# EAGLE schematic inktime_v6 (EAGLE 9.6.2)

## Sheet 1 of 2
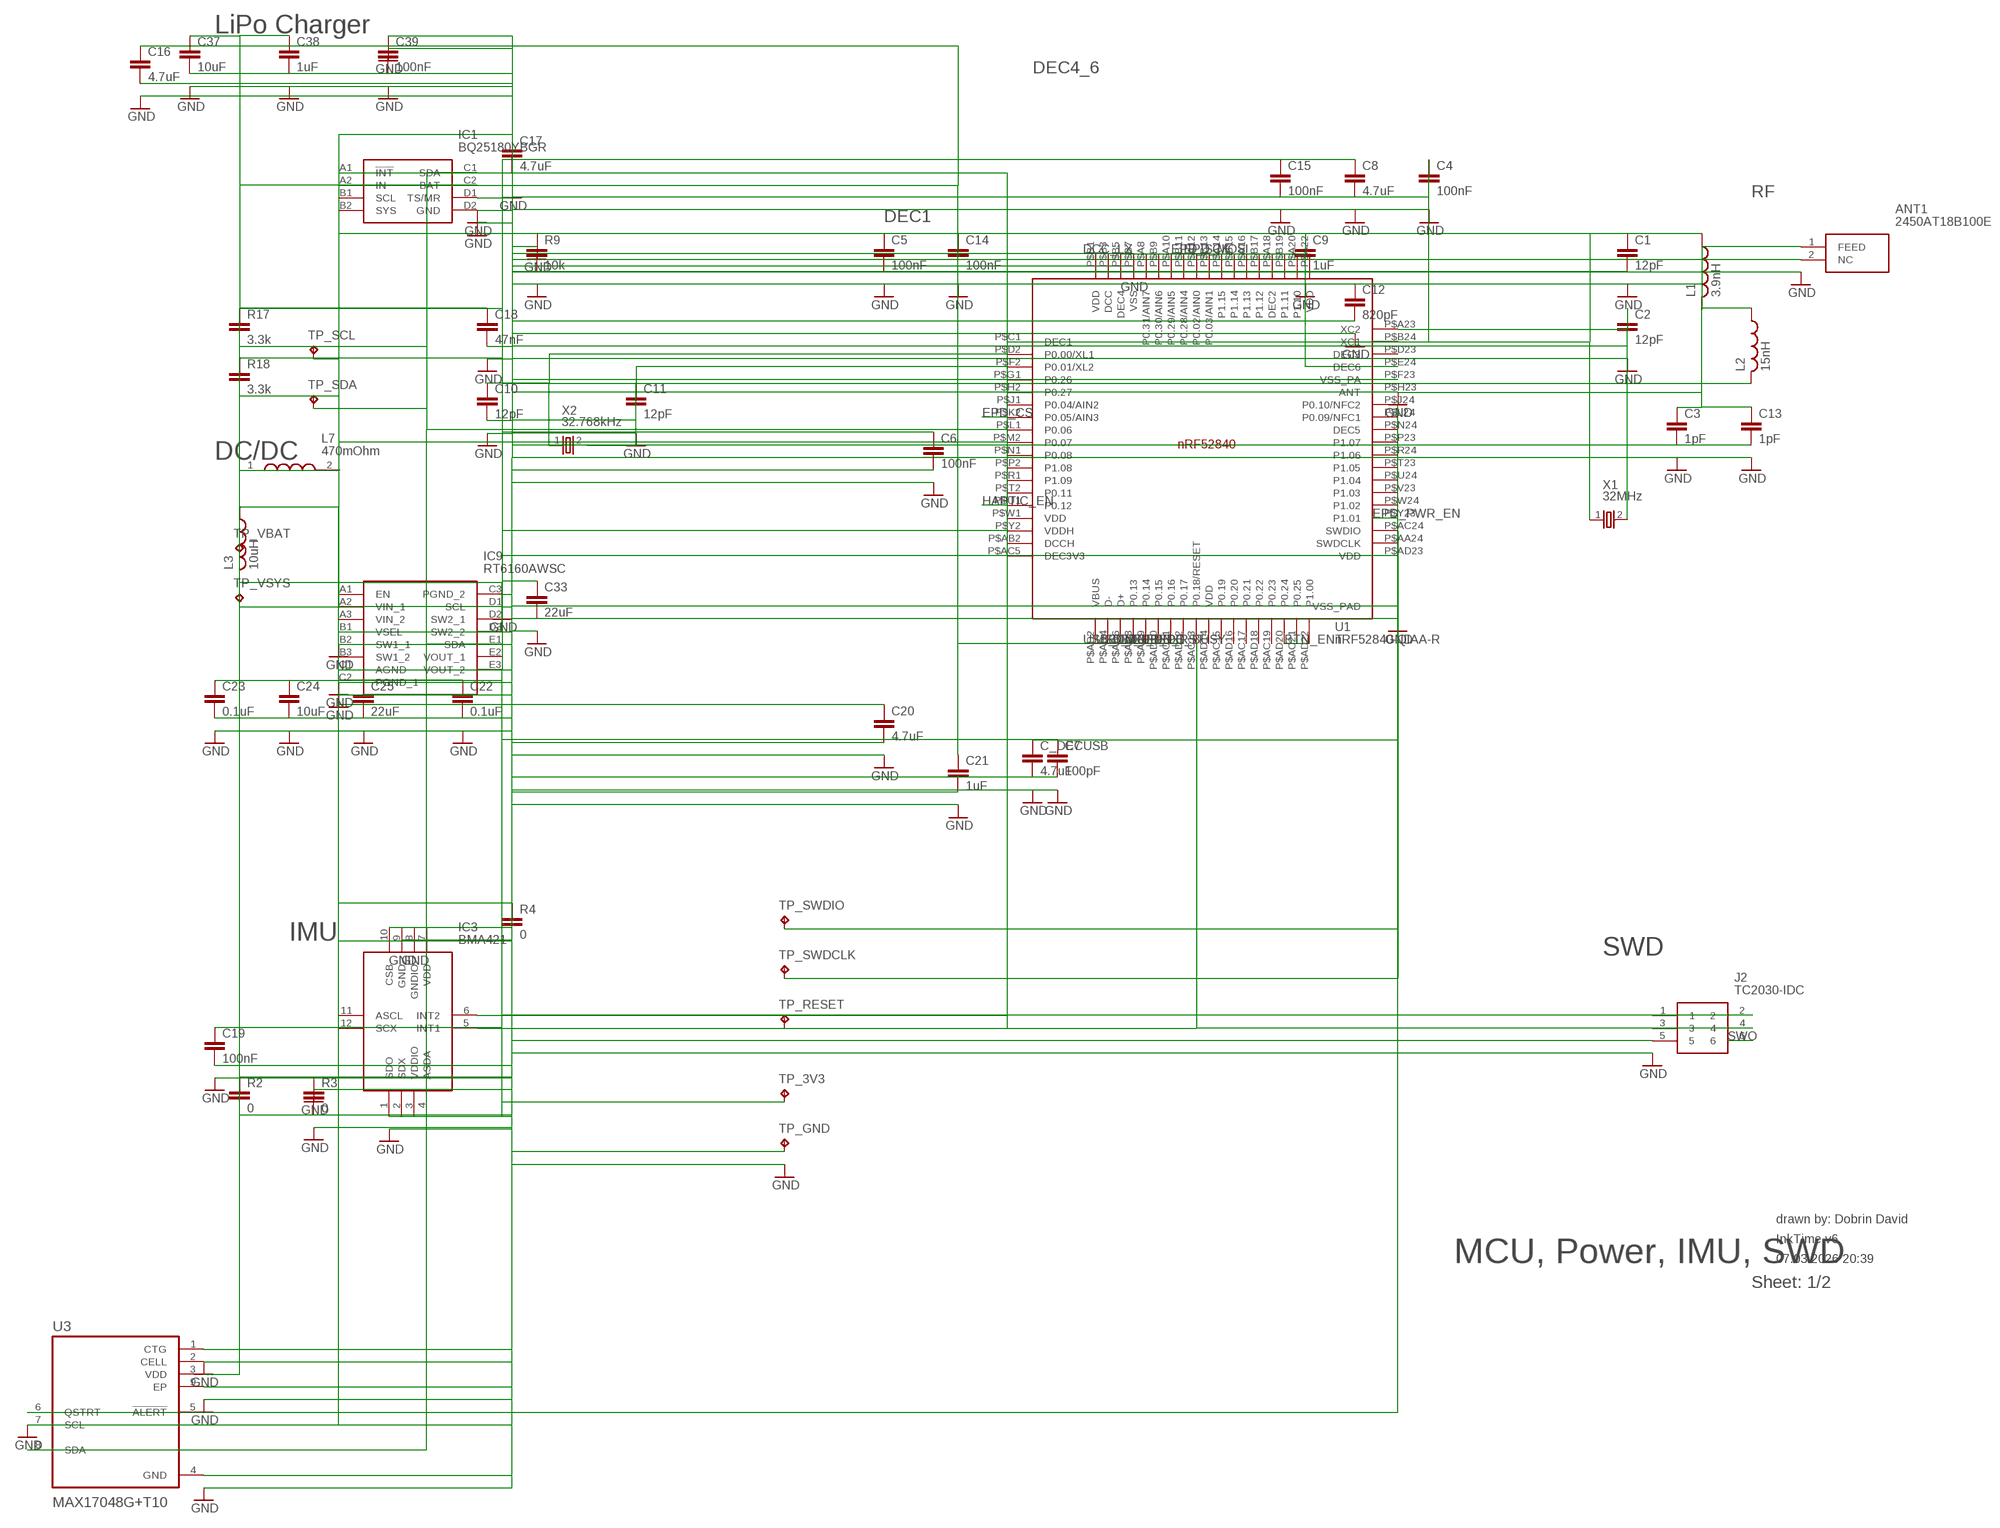
[diagram p0: schematic, sheet 1]

### Parts
ANT1  2450AT18B100E  2450AT18B100E_2450AT18B100E  [2450AT18B100E_ANTC3216X140N]
C1  12pF  PERFECT_0402_CAP_0402  [PERFECT_0402_0402]
C2  12pF  PERFECT_0402_CAP_0402  [PERFECT_0402_0402]
C3  1pF  PERFECT_0402_CAP_0402  [PERFECT_0402_0402]
C4  100nF  PERFECT_0402_CAP_0402  [PERFECT_0402_0402]
C5  100nF  PERFECT_0402_CAP_0402  [PERFECT_0402_0402]
C6  100nF  PERFECT_0402_CAP_0402  [PERFECT_0402_0402]
C7  100pF  PERFECT_0402_CAP_0402  [PERFECT_0402_0402]
C8  4.7uF  PERFECT_0402_CAP_0402  [PERFECT_0402_0402]
C9  1uF  PERFECT_0402_CAP_0402  [PERFECT_0402_0402]
C10  12pF  PERFECT_0402_CAP_0402  [PERFECT_0402_0402]
C11  12pF  PERFECT_0402_CAP_0402  [PERFECT_0402_0402]
C12  820pF  PERFECT_0402_CAP_0402  [PERFECT_0402_0402]
C13  1pF  PERFECT_0402_CAP_0402  [PERFECT_0402_0402]
C14  100nF  PERFECT_0402_CAP_0402  [PERFECT_0402_0402]
C15  100nF  PERFECT_0402_CAP_0402  [PERFECT_0402_0402]
C16  4.7uF  PERFECT_0402_CAP_0402  [PERFECT_0402_0402]
C17  4.7uF  PERFECT_0402_CAP_0402  [PERFECT_0402_0402]
C18  47nF  PERFECT_0402_CAP_0402  [PERFECT_0402_0402]
C19  100nF  PERFECT_0402_CAP_0402  [PERFECT_0402_0402]
C20  4.7uF  PERFECT_0402_CAP_0402  [PERFECT_0402_0402]
C21  1uF  PERFECT_0402_CAP_0402  [PERFECT_0402_0402]
C22  0.1uF  PERFECT_0402_CAP_0402  [PERFECT_0402_0402]
C23  0.1uF  PERFECT_0402_CAP_0402  [PERFECT_0402_0402]
C24  10uF  PERFECT_0402_CAP_0402  [PERFECT_0402_0402]
C25  22uF  PERFECT_0402_CAP_0402  [PERFECT_0402_0402]
C33  22uF  PERFECT_0402_CAP_0402  [PERFECT_0402_0402]
C37  10uF  PERFECT_0402_CAP_0402  [PERFECT_0402_0402]
C38  1uF  PERFECT_0402_CAP_0402  [PERFECT_0402_0402]
C39  100nF  PERFECT_0402_CAP_0402  [PERFECT_0402_0402]
C_DECUSB  4.7uF  PERFECT_0402_CAP_0402  [PERFECT_0402_0402]
IC1  BQ25180YBGR  BQ25180YBGR_BQ25180YBGR  [BQ25180YBGR_BGA8C40P2X4_100X155X50]
IC3  BMA421  BMA423_BMA423  [BMA423_BMA423]
IC9  RT6160AWSC  RT6160AWSC_RT6160AWSC  [RT6160AWSC_BGA15C40P3X5_140X230X60]
J2  TC2030-IDC  TC2030-IDC_TC2030-IDC  [TC2030-IDC_TC2030IDC]
L1  3.9nH  NORDIC_NRF_2_INDUCTOR_0402_N  [NORDIC_NRF_2_RESC0402_N]
L2  15nH  NORDIC_NRF_2_INDUCTOR_0402_N  [NORDIC_NRF_2_RESC0402_N]
L3  10uH  NORDIC_NRF_2_INDUCTOR_0402_N  [NORDIC_NRF_2_RESC0402_N]
L7  470mOhm  MLP2016SR47MT0S1_FTC252012SR47MBCA  [MLP2016SR47MT0S1_INDC2016X100N]
R2  0  PERFECT_0402_CAP_0402  [PERFECT_0402_0402]
R3  0  PERFECT_0402_CAP_0402  [PERFECT_0402_0402]
R4  0  PERFECT_0402_CAP_0402  [PERFECT_0402_0402]
R9  10k  PERFECT_0402_CAP_0402  [PERFECT_0402_0402]
R17  3.3k  PERFECT_0402_CAP_0402  [PERFECT_0402_0402]
R18  3.3k  PERFECT_0402_CAP_0402  [PERFECT_0402_0402]
TP_3V3  TP  HECTOR_WATCH_1_TPTP20R  [HECTOR_WATCH_1_TP20R]
TP_GND  TP  HECTOR_WATCH_1_TPTP20R  [HECTOR_WATCH_1_TP20R]
TP_RESET  TP  HECTOR_WATCH_1_TPTP20R  [HECTOR_WATCH_1_TP20R]
TP_SCL  TP  HECTOR_WATCH_1_TPTP20R  [HECTOR_WATCH_1_TP20R]
TP_SDA  TP  HECTOR_WATCH_1_TPTP20R  [HECTOR_WATCH_1_TP20R]
TP_SWDCLK  TP  HECTOR_WATCH_1_TPTP20R  [HECTOR_WATCH_1_TP20R]
TP_SWDIO  TP  HECTOR_WATCH_1_TPTP20R  [HECTOR_WATCH_1_TP20R]
TP_VBAT  TP  HECTOR_WATCH_1_TPTP20R  [HECTOR_WATCH_1_TP20R]
TP_VSYS  TP  HECTOR_WATCH_1_TPTP20R  [HECTOR_WATCH_1_TP20R]
U1  nRF52840-QIAA-R  NORDIC_NRF_4_NRF52840_QF  [NORDIC_NRF_4_AQFN50P700X700X85_HS-74N]
U3  MAX17048G+T10  ESP32_C6_LIBRARY_MAX17048G+T10  [ESP32_C6_LIBRARY_SON50P200X200X80-9N]
X1  32MHz  NORDIC_NRF_1_XTAL_32KHZ  [NORDIC_NRF_1_XTAL_3215_N]
X2  32.768kHz  NORDIC_NRF_1_XTAL_32KHZ  [NORDIC_NRF_1_XTAL_3215_N]

### Nets
3V3 [Power]: C5.1 C6.1 C7.1 C8.1 C14.1 C15.1 C19.1 C24.1 C25.1 C33.1 IC3.3(VDDIO) IC3.7(VDD) IC3.10(CSB) IC9.E2(VOUT_1) IC9.E3(VOUT_2) J2.1 R2.1 R2.2 R17.1 R18.1 TP_3V3.TP U1.P$AD23(VDD) U1.P$Y2(VDDH) ; also sheet 2
BTN_DN: U1.P$AC9(P0.14) ; also sheet 2
BTN_ENT: U1.P$AD22(P1.00) ; also sheet 2
BTN_UP: U1.P$AD8(P0.13) ; also sheet 2
DCC_LX: U1.P$B3(DCC)
DEC1: C4.1 U1.P$C1(DEC1)
DEC4_6: C9.1 U1.P$B5(DEC4) U1.P$E24(DEC6)
DECUSB: C_DECUSB.1 U1.P$N24(DEC5)
EPD_BUSY: U1.P$AD12(P0.17)
EPD_CS: U1.P$K2(P0.05/AIN3) ; also sheet 2
EPD_DC: U1.P$AD10(P0.15) ; also sheet 2
EPD_MOSI: U1.P$B13(P0.03/AIN1) ; also sheet 2
EPD_PWR_EN: U1.P$Y23(P1.01) ; also sheet 2
EPD_RST: U1.P$AC11(P0.16)
EPD_SCK: U1.P$A12(P0.02/AIN0) ; also sheet 2
FUEL_ALRT: U1.P$J24(P0.10/NFC2) U3.5(!ALERT)
GND [Power]: ANT1.2(NC) C1.2 C2.2 C3.2 C4.2 C5.2 C6.2 C7.2 C8.2 C9.2 C10.2 C11.2 C12.2 C13.2 C14.2 C15.2 C16.2 C17.2 C18.2 C19.2 C20.2 C21.2 C22.2 C23.2 C24.2 C25.2 C33.2 C37.2 C38.2 C39.1 C39.2 C_DECUSB.2 IC1.D1(TS/MR) IC1.D2(GND) IC3.1(SDO) IC3.8(GNDIO) IC3.9(GND) IC9.B1(VSEL) IC9.C1(AGND) IC9.C2(PGND_1) IC9.C3(PGND_2) J2.5 R3.1 R3.2 R9.1 R9.2 TP_GND.TP U1.P$74(VSS_PAD) U1.P$75(VSS_PAD) U1.P$76(VSS_PAD) U1.P$77(VSS_PAD) U1.P$78(VSS_PAD) U1.P$79(VSS_PAD) U1.P$80(VSS_PAD) U1.P$81(VSS_PAD) U1.P$82(VSS_PAD) U1.P$83(VSS_PAD) U1.P$84(VSS_PAD) U1.P$85(VSS_PAD) U1.P$86(VSS_PAD) U1.P$87(VSS_PAD) U1.P$88(VSS_PAD) U1.P$89(VSS_PAD) U1.P$90(VSS_PAD) U1.P$B7(VSS) U1.P$F23(VSS_PA) U3.1(CTG) U3.4(GND) U3.6(QSTRT) U3.9(EP) ; also sheet 2
HAPTIC_EN: U1.P$U1(P0.12) ; also sheet 2
IMU_INT1: IC3.5(INT1) U1.P$N1(P0.08)
IMU_INT2: IC3.6(INT2) U1.P$P2(P1.08)
nRESET: J2.3 TP_RESET.TP U1.P$AC13(P0.18/RESET)
PMIC_INT: IC1.A1(!INT) U1.P$T2(P0.11)
RF_ANT: ANT1.1(FEED) C3.1 C12.1 C13.1 L1.2 L2.1 U1.P$H23(ANT)
RF_LX1: IC9.B2(SW1_1) IC9.B3(SW1_2) L1.1 L3.1
RF_LX2: IC9.D2(SW2_1) IC9.D3(SW2_2) L2.2 L3.2
SCL: IC1.B1(SCL) IC3.11(ASCL) IC3.12(SCX) IC9.D1(SCL) R4.1 R4.2 R18.2 TP_SCL.TP U1.P$M2(P0.07) U3.7(SCL) ; also sheet 2
SDA: IC1.C1(SDA) IC3.2(SDX) IC3.4(ASDA) IC9.E1(SDA) R17.2 TP_SDA.TP U1.P$L1(P0.06) U3.8(SDA) ; also sheet 2
SWDCLK: J2.4 TP_SWDCLK.TP U1.P$AA24(SWDCLK)
SWDIO: J2.2 TP_SWDIO.TP U1.P$AC24(SWDIO)
SWO: J2.6
USB_DM: U1.P$AD4(D-) ; also sheet 2
USB_DP: U1.P$AD6(D+) ; also sheet 2
VBAT [Power]: C18.1 C37.1 C38.1 IC1.C2(BAT) TP_VBAT.TP U3.2(CELL) U3.3(VDD)
VBUS [Power]: C16.1 C21.1 IC1.A2(IN) U1.P$AD2(VBUS) ; also sheet 2
VSYS [Power]: C17.1 C20.1 C22.1 C23.1 IC1.B2(SYS) IC9.A1(EN) IC9.A2(VIN_1) IC9.A3(VIN_2) L7.1 L7.2 TP_VSYS.TP
XC1_32K: C1.1 U1.P$B24(XC1) X1.1
XC2_32K: C2.1 U1.P$A23(XC2) X1.2
XL1: C10.1 U1.P$D2(P0.00/XL1) X2.1
XL2: C11.1 U1.P$F2(P0.01/XL2) X2.2
Unconnected: U1.P$A8(P0.31/AIN7) U1.P$A10(P0.29/AIN5) U1.P$A14(P1.15) U1.P$A16(P1.13) U1.P$A18(DEC2) U1.P$A20(P1.10) U1.P$AB2(DCCH) U1.P$AC5(DEC3V3) U1.P$AC15(P0.19) U1.P$AC17(P0.21) U1.P$AC19(P0.23) U1.P$AC21(P0.25) U1.P$AD16(P0.20) U1.P$AD18(P0.22) U1.P$AD20(P0.24) U1.P$B9(P0.30/AIN6) U1.P$B11(P0.28/AIN4) U1.P$B15(P1.14) U1.P$B17(P1.12) U1.P$B19(P1.11) U1.P$D23(DEC3) U1.P$G1(P0.26) U1.P$H2(P0.27) U1.P$J1(P0.04/AIN2) U1.P$L24(P0.09/NFC1) U1.P$P23(P1.07) U1.P$R1(P1.09) U1.P$R24(P1.06) U1.P$T23(P1.05) U1.P$U24(P1.04) U1.P$V23(P1.03) U1.P$W24(P1.02)

### Notes on the sheet
- LiPo Charger
- DEC4_6
- RF
- DEC1
- DC/DC
- IMU
- SWD
- drawn by: Dobrin David
- InkTime v6
- MCU, Power, IMU, SWD | 07.03.2026 20:39
- Sheet: 1/2

## Sheet 2 of 2
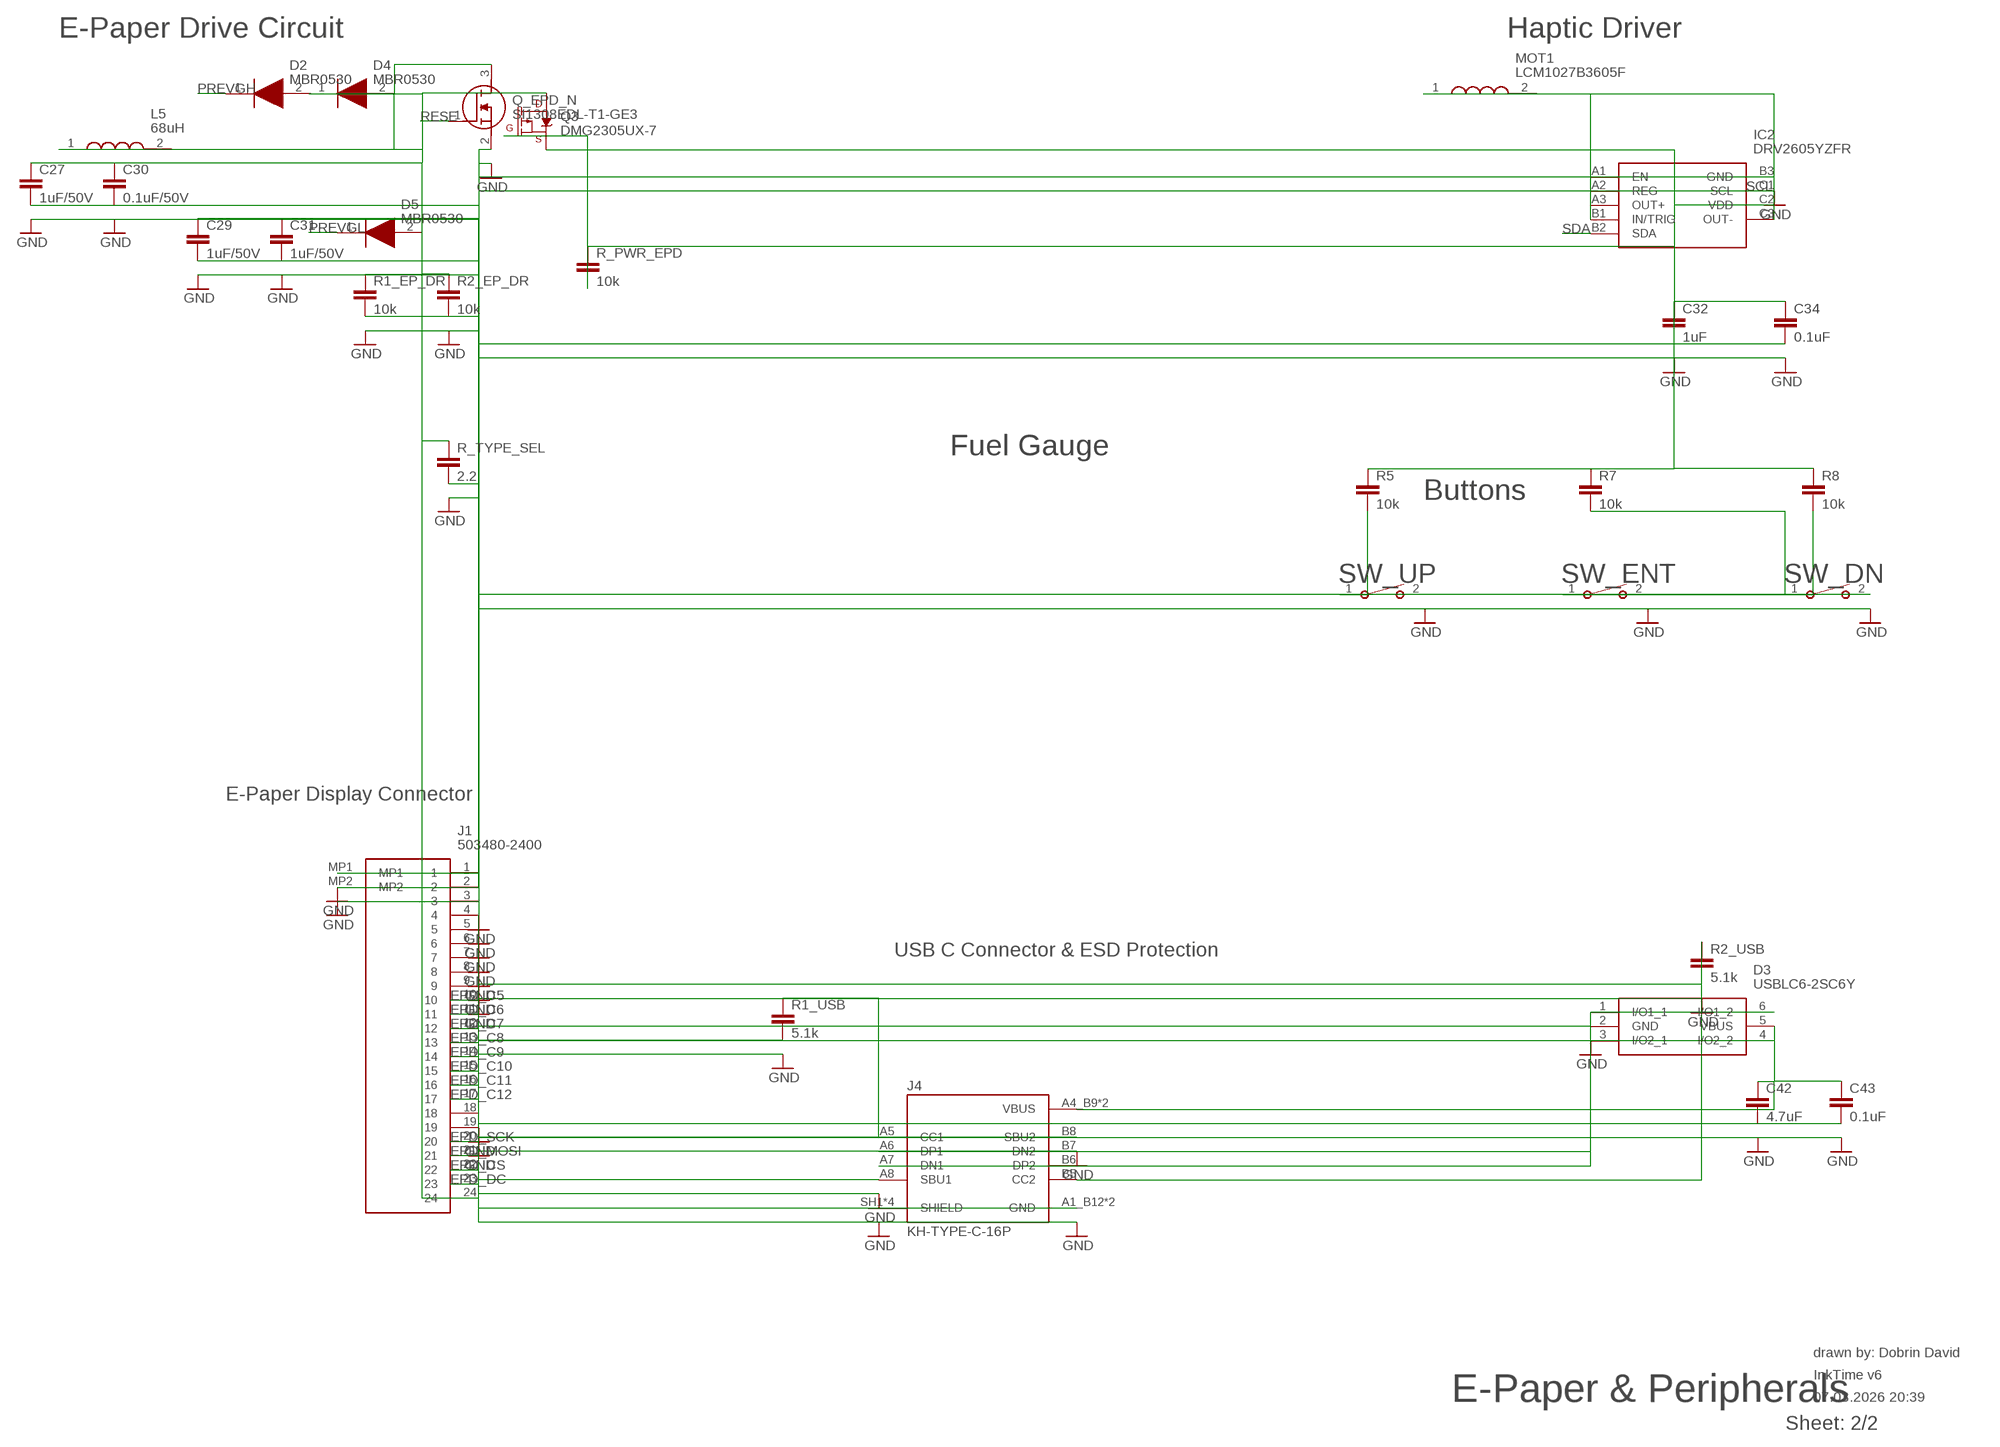
[diagram p1: schematic, sheet 2]

### Parts
C27  1uF/50V  PERFECT_0402_CAP_0402  [PERFECT_0402_0402]
C29  1uF/50V  PERFECT_0402_CAP_0402  [PERFECT_0402_0402]
C30  0.1uF/50V  PERFECT_0402_CAP_0402  [PERFECT_0402_0402]
C31  1uF/50V  PERFECT_0402_CAP_0402  [PERFECT_0402_0402]
C32  1uF  PERFECT_0402_CAP_0402  [PERFECT_0402_0402]
C34  0.1uF  PERFECT_0402_CAP_0402  [PERFECT_0402_0402]
C42  4.7uF  PERFECT_0402_CAP_0402  [PERFECT_0402_0402]
C43  0.1uF  PERFECT_0402_CAP_0402  [PERFECT_0402_0402]
D2  MBR0530  ESP32_C6_LIBRARY_5_MBR0530  [ESP32_C6_LIBRARY_5_SOD3716X135N]
D3  USBLC6-2SC6Y  ESP32_C6_LIBRARY_3_USBLC6-2SC6Y  [ESP32_C6_LIBRARY_3_SOT95P280X145-6N]
D4  MBR0530  ESP32_C6_LIBRARY_5_MBR0530  [ESP32_C6_LIBRARY_5_SOD3716X135N]
D5  MBR0530  ESP32_C6_LIBRARY_5_MBR0530  [ESP32_C6_LIBRARY_5_SOD3716X135N]
IC2  DRV2605YZFR  DRV2605YZFR_DRV2605YZFR  [DRV2605YZFR_BGA9C50P3X3_144X144X62]
J1  503480-2400  503480-2400_503480-2400  [503480-2400_5034802400]
J4  KH-TYPE-C-16P  KH-TYPE-C-16P_KH-TYPE-C-16P  [KH-TYPE-C-16P_KINGHELM_KH-TYPE-C-16P]
L5  68uH  MLP2016SR47MT0S1_FTC252012SR47MBCA  [MLP2016SR47MT0S1_INDC2016X100N]
MOT1  LCM1027B3605F  MLP2016SR47MT0S1_FTC252012SR47MBCA  [MLP2016SR47MT0S1_INDC2016X100N]
Q3  DMG2305UX-7  ESP32_C6_LIBRARY_4_ESP32_WROVER_SPARKFUN-DISCRETESEMI_MOSFET_PCH-SI2309DS  [ESP32_C6_LIBRARY_4_ESP32_C6_LIBRARY_4_ESP32_C6_LIBRARY_4_ESP32_C6_LIBRARY_4_ESP32_WROVER_SPARKFUN-DISCRETESEMI_SOT23-3]
Q_EPD_N  SI1308EDL-T1-GE3  ESP32_C6_LIBRARY_6_SI1308EDL-T1-GE3  [ESP32_C6_LIBRARY_6_SOT65P210X110-3N]
R1_EP_DR  10k  PERFECT_0402_CAP_0402  [PERFECT_0402_0402]
R1_USB  5.1k  PERFECT_0402_CAP_0402  [PERFECT_0402_0402]
R2_EP_DR  10k  PERFECT_0402_CAP_0402  [PERFECT_0402_0402]
R2_USB  5.1k  PERFECT_0402_CAP_0402  [PERFECT_0402_0402]
R5  10k  PERFECT_0402_CAP_0402  [PERFECT_0402_0402]
R7  10k  PERFECT_0402_CAP_0402  [PERFECT_0402_0402]
R8  10k  PERFECT_0402_CAP_0402  [PERFECT_0402_0402]
R_PWR_EPD  10k  PERFECT_0402_CAP_0402  [PERFECT_0402_0402]
R_TYPE_SEL  2.2  PERFECT_0402_CAP_0402  [PERFECT_0402_0402]
SW_DN  SW_PUSH  2025-10-22_07-23-44_LIBRARY_EVP-AKE31ASW_EVP-AKE31A_PAN  [2025-10-22_07-23-44_LIBRARY_SW_EVP-AKE31A_PAN]
SW_ENT  SW_PUSH  2025-10-22_07-23-44_LIBRARY_EVP-AKE31ASW_EVP-AKE31A_PAN  [2025-10-22_07-23-44_LIBRARY_SW_EVP-AKE31A_PAN]
SW_UP  SW_PUSH  2025-10-22_07-23-44_LIBRARY_EVP-AKE31ASW_EVP-AKE31A_PAN  [2025-10-22_07-23-44_LIBRARY_SW_EVP-AKE31A_PAN]

### Nets
3V3 [Power]: C32.1 C34.1 IC2.C2(VDD) Q3.2(S) R5.1 R7.1 R8.1 R_PWR_EPD.1 ; also sheet 1
BTN_DN: R7.2 SW_DN.1 ; also sheet 1
BTN_ENT: R8.2 SW_ENT.1 ; also sheet 1
BTN_UP: R5.2 SW_UP.1 ; also sheet 1
EPD_3V3 [Power]: C27.1 C30.1 D4.1(K) D5.2(A) J1.24 L5.2 Q3.3(D) R1_EP_DR.1 R2_EP_DR.1 R_TYPE_SEL.1
EPD_C1: C29.1 J1.2
EPD_C2: C31.1 J1.1
EPD_C5: J1.10
EPD_C6: J1.11
EPD_C7: J1.12
EPD_C8: J1.13
EPD_C9: J1.14
EPD_C10: J1.15
EPD_C11: J1.16
EPD_C12: J1.17
EPD_CS: J1.22 ; also sheet 1
EPD_DC: J1.23 ; also sheet 1
EPD_MOSI: J1.21 ; also sheet 1
EPD_PWR_EN: Q3.1(G) R_PWR_EPD.2 ; also sheet 1
EPD_SCK: J1.20 ; also sheet 1
GND [Power]: C27.2 C29.2 C30.2 C31.2 C32.2 C34.2 C42.2 C43.2 D3.2(GND) IC2.B3(GND) J1.3 J1.4 J1.5 J1.6 J1.7 J1.8 J1.9 J1.18 J1.19 J1.MP1 J1.MP2 J4.A1_B12(GND) J4.A8(SBU1) J4.A12_B1(GND) J4.B8(SBU2) J4.SH1(SHIELD) J4.SH2(SHIELD) J4.SH3(SHIELD) J4.SH4(SHIELD) Q_EPD_N.2(S) R1_EP_DR.2 R1_USB.2 R2_EP_DR.2 R2_USB.2 R_TYPE_SEL.2 SW_DN.2 SW_ENT.2 SW_UP.2 ; also sheet 1
HAPTIC_EN: IC2.A1(EN) IC2.B1(IN/TRIG) ; also sheet 1
HAPTIC_OUT_N: IC2.C3(OUT-) MOT1.2
HAPTIC_OUT_P: IC2.A3(OUT+) MOT1.1
LX_EPD: D2.2(A) D4.2(A) L5.1 Q_EPD_N.3(D)
PREVGH: D2.1(K)
PREVGL: D5.1(K)
RESE: Q_EPD_N.1(G)
SCL: IC2.C1(SCL) ; also sheet 1
SDA: IC2.B2(SDA) ; also sheet 1
USB_CC1: J4.A5(CC1) R1_USB.1
USB_CC2: J4.B5(CC2) R2_USB.1
USB_DM: D3.3(I/O2_1) D3.4(I/O2_2) J4.A7(DN1) J4.B7(DN2) ; also sheet 1
USB_DP: D3.1(I/O1_1) D3.6(I/O1_2) J4.A6(DP1) J4.B6(DP2) ; also sheet 1
VBUS [Power]: C42.1 C43.1 D3.5(VBUS) J4.A4_B9(VBUS) J4.A9_B4(VBUS) ; also sheet 1
Unconnected: IC2.A2(REG)

### Notes on the sheet
- E-Paper Drive Circuit | Haptic Driver
- Fuel Gauge
- Buttons
- E-Paper Display Connector
- USB C Connector & ESD Protection
- drawn by: Dobrin David
- InkTime v6
- E-Paper & Peripherals | 07.03.2026 20:39
- Sheet: 2/2

## Power pins joined to a net without a drawn wire
VDD: U1.P$A22(VDD) U1.P$AD14(VDD) U1.P$B1(VDD) U1.P$W1(VDD)

## Library data of the parts
ANT1 = inktime_v5:2450AT18B100E_2450AT18B100E: Antennas 2.45GHz ANTENNA Source: Datasheet <https://www.johansontechnology.com/datasheets/2450AT18B100/2450AT18B100.pdf>
C1-C25 C27 C29-C34 C37-C39 C42 C43 C_DECUSB R1_EP_DR R1_USB R2 R2_EP_DR R2_USB R3-R5 R7-R9 R17 R18 R_PWR_EPD R_TYPE_SEL = inktime_v5:PERFECT_0402_CAP_0402: 0402 (1005 Metric) Nick Garner - TeleSense
D2 D4 D5 = inktime_v5:ESP32_C6_LIBRARY_5_MBR0530: ON SEMICONDUCTOR - MBR0530 - DIODE, SCHOTTKY, 0.5A, 30V, SOD-123 Source: Datasheet <http://www.onsemi.com/pub/Collateral/MBR0530T1-D.PDF> Check availability <https://pricing.snapeda.com/parts/MBR0530/ON%20Semiconductor/view-part?ref=eda>
D3 = inktime_v5:ESP32_C6_LIBRARY_3_USBLC6-2SC6Y: Low Cap. ESD Protection Auto SOT-23-6 STMicroelectronics USBLC6-2SC6Y, Dual Uni-Directional TVS Diode Array, 6-Pin SOT-23 Source: Datasheet <https://componentsearchengine.com/Datasheets/1/USBLC6-2SC6Y.pdf> Check availability <https://pricing.snapeda.com/parts/USBLC6-2SC6Y/STMicroelectronics/view-part?ref=eda>
IC1 = inktime_v5:BQ25180YBGR_BQ25180YBGR: Charger IC Lithium Ion/Polymer, Lithium Iron Phosphate 8-DSBGA (1.6x1.1) Source: Datasheet <https://www.ti.com/lit/ds/symlink/bq25180.pdf?ts=1650264094470&ref_url=https%3A%2F%2Fwww.ti.com%2Fproduct%2FBQ25180>
IC2 = inktime_v5:DRV2605YZFR_DRV2605YZFR: Haptic Driver for ERM/LRA with Built-In Library and Smart Loop Architecture Source: Datasheet <http://www.ti.com/lit/gpn/drv2605>
IC3 = inktime_v5:BMA423_BMA423: Accelerometers Triaxial low-g 12bit Acceleration Sensor Source: Datasheet <https://www.mouser.com/datasheet/2/783/BST-BMA423-DS000-1509600.pdf>
IC9 = inktime_v5:RT6160AWSC_RT6160AWSC: Buck-Boost Regulator Positive Output Step-Up/Step-Down I2C DC-DC Controller IC 15-WL-CSP (BSC) (1.4x2.3) Source: Datasheet <https://www.richtek.com/SaveDownload.aspx?specid=RT6160A>
J1 = inktime_v5:503480-2400_503480-2400: FFC & FPC Connectors 0.5mm FPC RA SMT Dual Contact 24Ckt Source: Datasheet <https://componentsearchengine.com/Datasheets/1/503480-2400.pdf>
J2 = inktime_v5:TC2030-IDC_TC2030-IDC: CABLE ADAPTER 6 POS Source: Datasheet <https://datasheet.datasheetarchive.com/originals/distributors/Datasheets_SAMA/62bc384e093448baaaa63dbd0b9d8707.pdf>
J4 = inktime_v5:KH-TYPE-C-16P_KH-TYPE-C-16P: Check availability <https://pricing.snapeda.com/parts/KH-TYPE-C-16P/kinghelm/view-part?ref=eda>
L1-L3 = inktime_v5:NORDIC_NRF_2_INDUCTOR: Generic chip inductor
L5 L7 MOT1 = inktime_v5:MLP2016SR47MT0S1_FTC252012SR47MBCA: SMD / SMT Inductors (Coils), L=0.47?H, L x W x T : Source: Datasheet <https://product.tdk.com/system/files/dam/doc/product/inductor/inductor/smd/catalog/inductor_commercial_power_mlp2016_en.pdf>
Q3 = inktime_v5:ESP32_C6_LIBRARY_4_ESP32_WROVER_SPARKFUN-DISCRETESEMI_MOSFET_PCH: P-channel MOSFETs Voltage controlled devices that allow control of high current outputs. SparkFun Products: SparkFun ESP32 Thing <https://www.sparkfun.com/products/13907> SparkFun ESP8266 Thing <https://www.sparkfun.com/products/13231> SparkFun Pi Servo HAT V2 <https://www.sparkfun.com/products/15316> DMG2305UX-7 (20V/4.2A/SOT23-3)
Q_EPD_N = inktime_v5:ESP32_C6_LIBRARY_6_SI1308EDL-T1-GE3: MOSFET N-Ch 30V 1.5A TrenchFET SC70 Vishay Si1308EDL-T1-GE3 N-channel MOSFET Transistor, 1.5 A, 30 V, 3-Pin SC-70 Source: Datasheet <https://componentsearchengine.com/Datasheets/1/SI1308EDL-T1-GE3.pdf> Check availability <https://pricing.snapeda.com/parts/SI1308EDL-T1-GE3/Vishay%20Siliconix/view-part?ref=eda>
SW_DN SW_ENT SW_UP = inktime_v5:2025-10-22_07-23-44_LIBRARY_EVP-AKE31A
TP_3V3 TP_GND TP_RESET TP_SCL TP_SDA TP_SWDCLK TP_SWDIO TP_VBAT TP_VSYS = inktime_v5:HECTOR_WATCH_1_TP: Test pad
U1 = inktime_v5:NORDIC_NRF_4_NRF52840_QF: nRF52840 Features Advanced Single chip 2.4 GHz multi-protocol SoC 32-bit ARM Cortex-M4F Processor 1.7v to 5.5v operation 1MB flash + 256kB RAM Bluetooth 5 support for long range and high throughput 802.15.4 radio support On-chip NFC PPI –Programmable Peripheral Interconnect Automated power management system with automatic power management of each peripheral Configurable I/O mapping for analog and digital I/O 48 x GPIO 1 x QSPI 4 x Master/Slave SPI 2 x Two-wire interface (I²C) I²S interface 2 x UART 4 x PWM USB 2.0 controller ARM TrustZone CryptoCell-310 Cryptographic and security module AES 128-bit ECB/CCM/AAR hardware accelerator Digital microphone interface (PDM) Quadrature decoder 12-bit ADC Low power comparator On-chip 50Ω balun On-air compatible with nRF52, nRF51 and nRF24 Series Applications Advanced high performance wearables Wearables for secure payments Virtual Reality/Augmented Reality systems Smart Home sensor networks Smart city sensor networks High performance HID controllers Internet of Things (IoT) sensor networks Smart door locks Smart lighting networks Connected white goods
U3 = inktime_v5:ESP32_C6_LIBRARY_MAX17048G+T10: Check availability <https://pricing.snapeda.com/parts/MAX17048G%2BT10/Analog%20Devices/view-part?ref=eda>
X1 X2 = inktime_v5:NORDIC_NRF_1_XTAL_32KHZ

## Net classes
0 default: width 0.152 mm, drill 0.305 mm, clearance 0.152 mm
1 Power: width 0.305 mm, drill 0.305 mm, clearance 0.203 mm